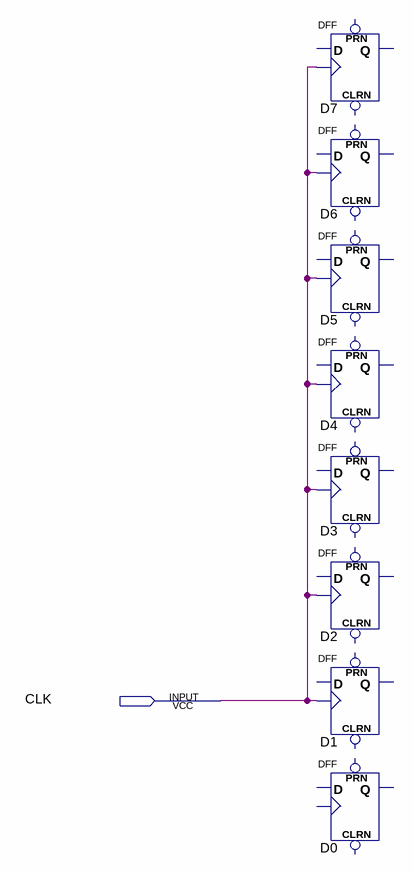
[diagram p0: schematic sheet]
// Quartus schematic MUX4_1.bdf as structural Verilog: 8 symbols, 1 pins
module MUX4_1 (
  input  CLK
);

  DFF D7 (.CLK(CLK));  // open: CLRN, D, PRN, Q
  DFF D6 (.CLK(CLK));  // open: CLRN, D, PRN, Q
  DFF D5 (.CLK(CLK));  // open: CLRN, D, PRN, Q
  DFF D4 (.CLK(CLK));  // open: CLRN, D, PRN, Q
  DFF D3 (.CLK(CLK));  // open: CLRN, D, PRN, Q
  DFF D2 (.CLK(CLK));  // open: CLRN, D, PRN, Q
  DFF D1 (.CLK(CLK));  // open: CLRN, D, PRN, Q
  DFF D0 ();  // open: CLRN, CLK, D, PRN, Q
endmodule
